# EAGLE schematic Tractive System Diagram Half Voltage (EAGLE 8.1.0)
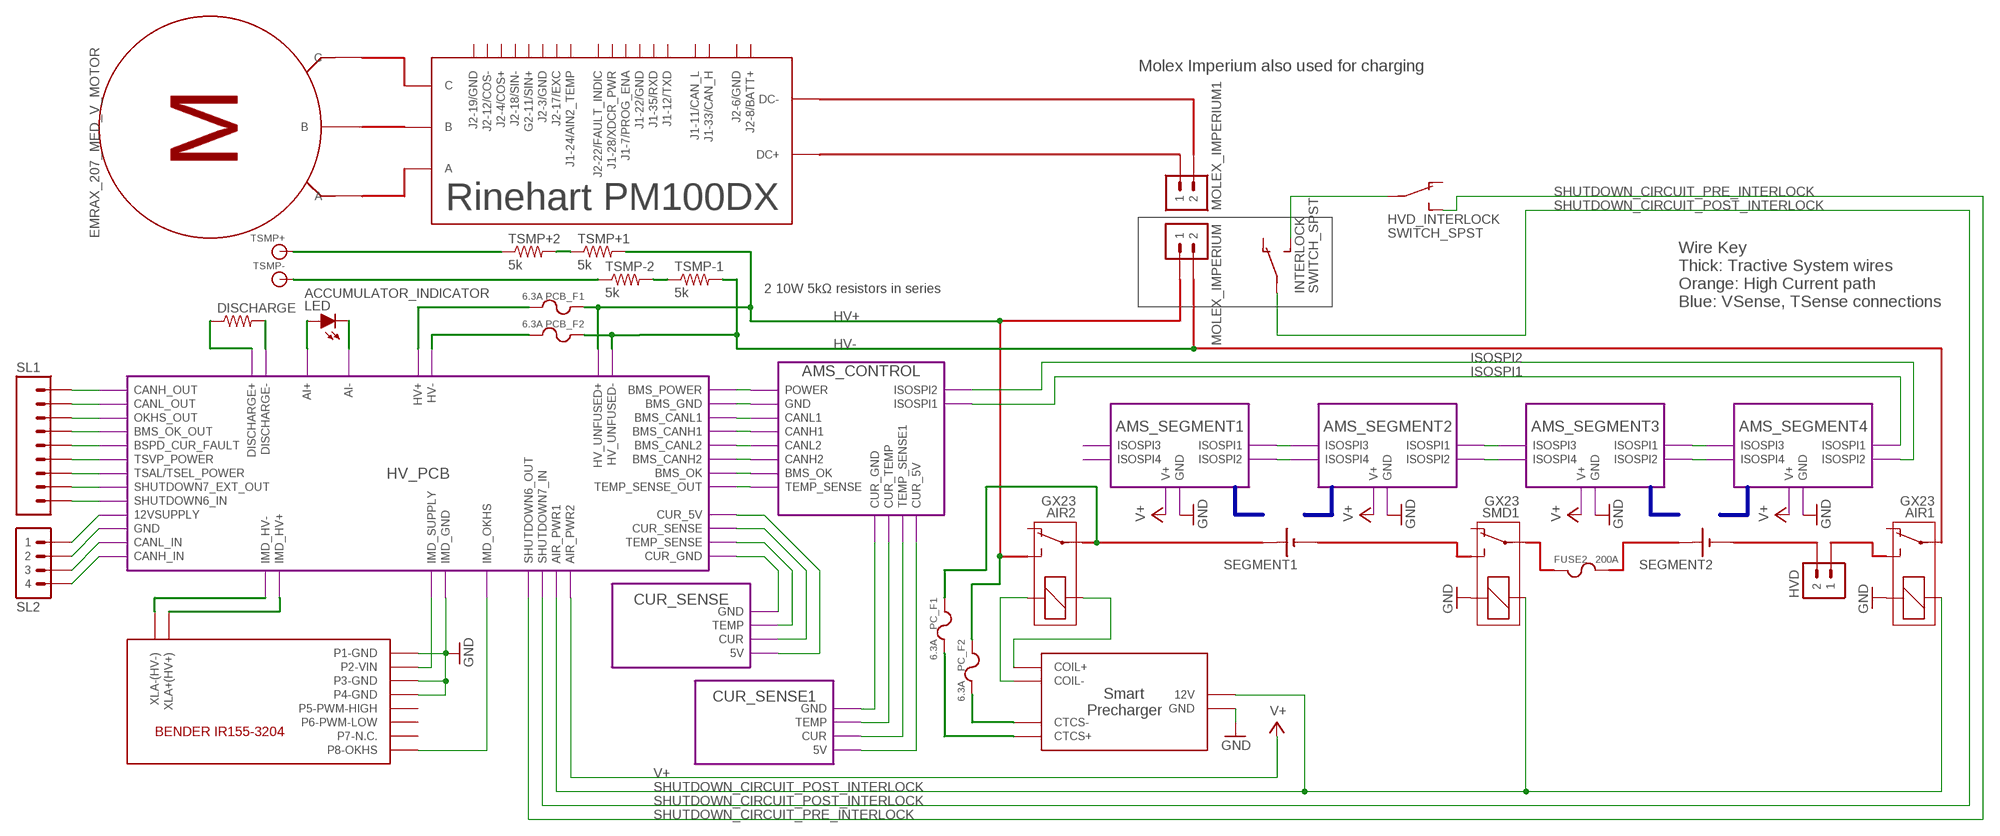
[diagram p0: schematic, sheet 1]

## Parts
ACCUMULATOR_INDICATOR  LED  (no package)
AIR1  GX23  RELAY  (no package)
AIR2  GX23  RELAY  (no package)
DISCHARGE  RESISTOR10W  [10W_RESISTOR_VISHAY]
EMRAX_207_MED_V_MOTOR  MOTOR_AC  (no package)
FUSE2  200A  FUSE  (no package)
HVD  M02  (no package)
HVD_INTERLOCK  SWITCH_SPST  (no package)
INTERLOCK  SWITCH_SPST  (no package)
MOLEX_IMPERIUM  M02  (no package)
MOLEX_IMPERIUM1  M02  (no package)
PC_F1  6.3A  FUSE  (no package)
PC_F2  6.3A  FUSE  (no package)
PCB_F1  6.3A  FUSE  (no package)
PCB_F2  6.3A  FUSE  (no package)
SEGMENT1  BATTERY_1_CELL  (no package)
SEGMENT2  BATTERY_1_CELL  (no package)
SL1  M09  (no package)
SL2  M04  (no package)
SMD1  GX23  RELAY  (no package)
TSMP+  BANANA_JACK  (no package)
TSMP+1  5k  RESISTOR10W  [10W_RESISTOR_VISHAY]
TSMP+2  5k  RESISTOR10W  [10W_RESISTOR_VISHAY]
TSMP-  BANANA_JACK  (no package)
TSMP-1  5k  RESISTOR10W  [10W_RESISTOR_VISHAY]
TSMP-2  5k  RESISTOR10W  [10W_RESISTOR_VISHAY]
U$1  SMART_PRECHARGER  (no package)
U$2  RINEHART_PM100DX  (no package)
U$4  BENDER_IR155-3204  (no package)

## Module instances
HV_PCB = HV_ECU
AMS_CONTROL = AMS_CONTROL
CUR_SENSE = BSPD_SENSE
AMS_SEGMENT1 = AMS_SEGMENT$A
AMS_SEGMENT2 = AMS_SEGMENT$A
AMS_SEGMENT3 = AMS_SEGMENT$A
AMS_SEGMENT4 = AMS_SEGMENT$A
CUR_SENSE1 = BSPD_SENSE

## Nets
GND: AIR1.1 SMD1.1 U$1.GND U$4.P1-GND U$4.P3-GND U$4.P4-GND ; port HV_PCB.IMD_GND AMS_SEGMENT1.GND AMS_SEGMENT2.GND AMS_SEGMENT3.GND AMS_SEGMENT4.GND
HV+: PCB_F1.1 TSMP+1.2 ; port HV_PCB.HV_UNFUSED+
HV-: PCB_F2.1 TSMP-1.2 ; port HV_PCB.HV_UNFUSED-
ISOSPI1: port AMS_CONTROL.ISOSPI1 AMS_SEGMENT4.ISOSPI1
ISOSPI2: port AMS_CONTROL.ISOSPI2 AMS_SEGMENT4.ISOSPI2
N$1: TSMP+1.1 TSMP+2.2
N$2: TSMP-1.1 TSMP-2.2
N$3: port AMS_CONTROL.POWER HV_PCB.BMS_POWER
N$4: port CUR_SENSE1.GND AMS_CONTROL.CUR_GND
N$5: port CUR_SENSE1.TEMP AMS_CONTROL.CUR_TEMP
N$6: port AMS_SEGMENT2.ISOSPI3 AMS_SEGMENT1.ISOSPI1
N$7: port AMS_SEGMENT2.ISOSPI4 AMS_SEGMENT1.ISOSPI2
N$8: port AMS_SEGMENT3.ISOSPI3 AMS_SEGMENT2.ISOSPI1
N$9: port AMS_SEGMENT3.ISOSPI4 AMS_SEGMENT2.ISOSPI2
N$10: U$4.XLA-(HV-) ; port HV_PCB.IMD_HV-
N$11: PC_F2.1
N$12: U$4.XLA+(HV+) ; port HV_PCB.IMD_HV+
N$13: PC_F1.1
N$14: TSMP+2.1 TSMP+.1
N$15: port AMS_CONTROL.GND HV_PCB.BMS_GND
N$16: TSMP-2.1 TSMP-.1
N$17: ACCUMULATOR_INDICATOR.A ; port HV_PCB.AI+
N$18: ACCUMULATOR_INDICATOR.C ; port HV_PCB.AI-
N$19: port HV_PCB.BMS_CANL1 AMS_CONTROL.CANL1
N$20: AIR2.2 U$1.COIL+
N$21: AIR2.1 U$1.COIL-
N$22: PCB_F1.2 ; port HV_PCB.HV+
N$23: SL1.1 ; port HV_PCB.SHUTDOWN6_IN
N$24: PCB_F2.2 ; port HV_PCB.HV-
N$25: SL1.2 ; port HV_PCB.SHUTDOWN7_EXT_OUT
N$26: SL1.3 ; port HV_PCB.TSAL/TSEL_POWER
N$27: SL1.4 ; port HV_PCB.TSVP_POWER
N$28: SL1.5 ; port HV_PCB.BSPD_CUR_FAULT
N$29: SL1.6 ; port HV_PCB.BMS_OK_OUT
N$30: SL1.7 ; port HV_PCB.OKHS_OUT
N$31: port AMS_CONTROL.CANH1 HV_PCB.BMS_CANH1
N$32: U$4.P2-VIN ; port HV_PCB.IMD_SUPPLY
N$33: SL1.8 ; port HV_PCB.CANL_OUT
N$34: U$4.P8-OKHS ; port HV_PCB.IMD_OKHS
N$35: PC_F1.2 U$1.CTCS+
N$36: PC_F2.2 U$1.CTCS-
N$37: SL1.9 ; port HV_PCB.CANH_OUT
N$38: DISCHARGE.2 ; port HV_PCB.DISCHARGE-
N$39: DISCHARGE.1 ; port HV_PCB.DISCHARGE+
N$40: port HV_PCB.BMS_CANL2 AMS_CONTROL.CANL2
N$41: port AMS_CONTROL.CANH2 HV_PCB.BMS_CANH2
N$42: port AMS_CONTROL.TEMP_SENSE HV_PCB.TEMP_SENSE_OUT
N$43: SL2.1 ; port HV_PCB.12VSUPPLY
N$44: SL2.2 ; port HV_PCB.GND
N$45: SL2.3 ; port HV_PCB.CANL_IN
N$46: SL2.4 ; port HV_PCB.CANH_IN
N$47: port HV_PCB.CUR_GND CUR_SENSE.GND
N$48: port CUR_SENSE.TEMP HV_PCB.TEMP_SENSE
N$49: port CUR_SENSE.CUR HV_PCB.CUR_SENSE
N$50: port CUR_SENSE.5V HV_PCB.CUR_5V
N$51: port CUR_SENSE1.CUR AMS_CONTROL.TEMP_SENSE1
N$52: port CUR_SENSE1.5V AMS_CONTROL.CUR_5V
N$53: HVD_INTERLOCK.P INTERLOCK.S
N$54: port AMS_CONTROL.BMS_OK HV_PCB.BMS_OK
N$88: port AMS_SEGMENT4.ISOSPI3 AMS_SEGMENT3.ISOSPI1
N$89: port AMS_SEGMENT4.ISOSPI4 AMS_SEGMENT3.ISOSPI2
SHUTDOWN_CIRCUIT_POST_INTERLOCK: AIR1.2 INTERLOCK.P SMD1.2 U$1.12V ; port HV_PCB.SHUTDOWN7_IN HV_PCB.AIR_PWR1
SHUTDOWN_CIRCUIT_PRE_INTERLOCK: HVD_INTERLOCK.S ; port HV_PCB.SHUTDOWN6_OUT
V+: port HV_PCB.AIR_PWR2 AMS_SEGMENT1.V+ AMS_SEGMENT2.V+ AMS_SEGMENT3.V+ AMS_SEGMENT4.V+
Unconnected: AIR1.O AIR1.P AIR1.S AIR2.O AIR2.P AIR2.S EMRAX_207_MED_V_MOTOR.A EMRAX_207_MED_V_MOTOR.B EMRAX_207_MED_V_MOTOR.C FUSE2.1 FUSE2.2 HVD.1 HVD.2 HVD_INTERLOCK.O INTERLOCK.O MOLEX_IMPERIUM1.1 MOLEX_IMPERIUM1.2 MOLEX_IMPERIUM.1 MOLEX_IMPERIUM.2 SEGMENT1.+ SEGMENT1.- SEGMENT2.+ SEGMENT2.- SMD1.O SMD1.P SMD1.S U$2.A U$2.B U$2.C U$2.DC+ U$2.DC- U$2.G2-11/SIN+ U$2.J1-7/PROG_ENA U$2.J1-11/CAN_L U$2.J1-12/TXD U$2.J1-22/GND U$2.J1-24/AIN2_TEMP U$2.J1-28/XDCR_PWR U$2.J1-33/CAN_H U$2.J1-35/RXD U$2.J2-3/GND U$2.J2-4/COS+ U$2.J2-6/GND U$2.J2-8/BATT+ U$2.J2-12/COS- U$2.J2-17/EXC U$2.J2-18/SIN- U$2.J2-19/GND U$2.J2-22/FAULT_INDIC U$4.P5-PWM-HIGH U$4.P6-PWM-LOW U$4.P7-N.C.

## Buses
B$1
B$2
B$3
B$4

## Notes on the sheet
- Molex Imperium also used for charging
- 2 10W 5kΩ resistors in series
- Wire Key
  Thick: Tractive System wires
  Orange: High Current path
  Blue: VSense, TSense connections

## Library data of the parts
ACCUMULATOR_INDICATOR = HyTechSymbols:LED: Generic LED
AIR1 AIR2 SMD1 = HyTechSymbols:RELAY: RELAY 1 x switch
DISCHARGE TSMP+1 TSMP+2 TSMP-1 TSMP-2 = HyTechDevices:RESISTOR: Resistor Basic schematic elements and footprints for 0603, 1206, and PTH resistors.
EMRAX_207_MED_V_MOTOR = HyTechSymbols:MOTOR_AC: Generic three-phase AC electric motor
FUSE2 PC_F1 PC_F2 PCB_F1 PCB_F2 = HyTechSymbols:FUSE: Generic Fuse
HVD MOLEX_IMPERIUM MOLEX_IMPERIUM1 = HyTechSymbols:M02: Generic 2-pin connector
HVD_INTERLOCK INTERLOCK = HyTechSymbols:SWITCH_SPST: Single Pull Single Throw Switch
SEGMENT1 SEGMENT2 = HyTechSymbols:BATTERY_1_CELL: Generic 1-cell battery Source: Sonnenschein
SL1 = HyTechSymbols:M09: Generic 9-pin connector
SL2 = HyTechSymbols:M04: Generic 4-pin connector
TSMP+ TSMP- = HyTechSymbols:BANANA_JACK: Banana Jack Purchasing: Mouser - Red <http://www.mouser.com/ProductDetail/Pomona-Electronics/72930-2/?qs=2nDnb8a6ouM2t6dPw1JBow%3D%3D> Mouser - Black <http://www.mouser.com/ProductDetail/Pomona-Electronics/72930-0/?qs=2nDnb8a6ouNpA2wl9kKnzA%3D%3D>
U$1 = HyTechSymbols:SMART_PRECHARGER: Smart Precharger http://www.zeva.com.au/Products/datasheets/SmartPrechargerV1-3.pdf
U$2 = HyTechSymbols:RINEHART_PM100DX: Rinehart Motion Systems PM100DX Motor Inverter Product Page <http://www.rinehartmotion.com/standard.html> Datasheet <http://www.rinehartmotion.com/uploads/5/1/3/0/51309945/pm100-150datasheet_2.pdf>
U$4 = HyTechSymbols:BENDER_IR155-3204: Bender IR155-3204 Insulation Monitoring Device Datasheet <http://www.bender-es.com/fileadmin/products/doc/IR155-32xx-V004_D00115_D_XXEN.pdf>

## Module HV_ECU
Ports: TSVP_POWER(out) TSAL/TSEL_POWER(out) BSPD_CUR_FAULT(out) HV+(pas) HV-(pas) AI-(in) AI+(out) BMS_POWER(out) IMD_GND(out) OKHS_OUT(out) IMD_OKHS(in) BMS_GND(in) IMD_HV+(nc) IMD_HV-(nc) SHUTDOWN6_OUT(out) SHUTDOWN6_IN(in) SHUTDOWN7_EXT_OUT(out) BMS_OK_OUT(out) CANL_OUT(io) CANH_OUT(io) AIR_PWR1(out) AIR_PWR2(out) SHUTDOWN7_IN(in) DISCHARGE-(in) DISCHARGE+(out) BMS_CANL1(io) BMS_CANH1(io) BMS_CANL2(io) BMS_CANH2(io) TEMP_SENSE_OUT(out) IMD_SUPPLY(out) 12VSUPPLY(in) GND(out) CANL_IN(io) CANH_IN(io) CUR_SENSE(in) CUR_GND(in) CUR_5V(out) TEMP_SENSE(in) BMS_OK(in) HV_UNFUSED+(nc) HV_UNFUSED-(nc)

### Library data of the parts

## Module AMS_SEGMENT
Ports: ISOSPI1(io) ISOSPI2(io) ISOSPI3(io) ISOSPI4(io)

### Library data of the parts

## Module AMS_CONTROL
Ports: ISOSPI2(io) ISOSPI1(io) GND(out) POWER(in) CANL1(io) CANL2(io) CANH1(io) CANH2(io) TEMP_SENSE(in) BMS_OK(out) CUR_GND(in) CUR_TEMP(in) TEMP_SENSE1(in) CUR_5V(out)

### Library data of the parts

## Module BSPD_SENSE
Ports: GND(out) TEMP(out) CUR(out) 5V(in)

### Library data of the parts

## Module FSAE_ENERGY_METER
Ports: HV-OUT(nc) HV+OUT(nc) HV-IN(nc) HV+IN(nc) 12V+(in) GND(out)

### Library data of the parts

## Module AMS_SEGMENT$A
Ports: ISOSPI1(io) ISOSPI2(io) ISOSPI3(io) ISOSPI4(io) V+(in) GND(out)

### Library data of the parts